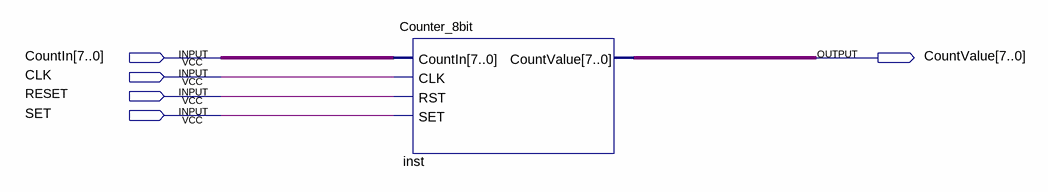
[diagram p0: schematic sheet]
// Quartus schematic Counter8bit.bdf as structural Verilog: 1 symbols, 5 pins
module Counter8bit (
  input  [7:0] CountIn,
  input  CLK,
  input  RESET,
  input  SET,
  output [7:0] CountValue
);

  Counter_8bit inst (.CountIn(CountIn), .CLK(CLK), .RST(RESET), .SET(SET), .CountValue(CountValue));
endmodule
